# Altium project Banker.PrjPCB (part 4 of 5)

## Sheet Supply.SchDoc: Power
size 420 x 297 mm; Author: G.K.; CompanyName: WUT; DrawnBy: G.K.; Organization: CERN; Address1: Warsaw Univeristy of Technology; Address2: Nowowiejska 15/19; DocumentNumber: 3; Revision: -; SheetNumber: 3; SheetTotal: 10; EDA_Number: ARTIQ; Projet: Banker; ModifiedBy: -; CreateDate: XX/XX/XXXX; CheckedDate: -; Title2: Supply; DivGrp: ISE; Designer: G.K.; ModifiedDate: -; ProjectName: ADC/DAC MEZZANINE
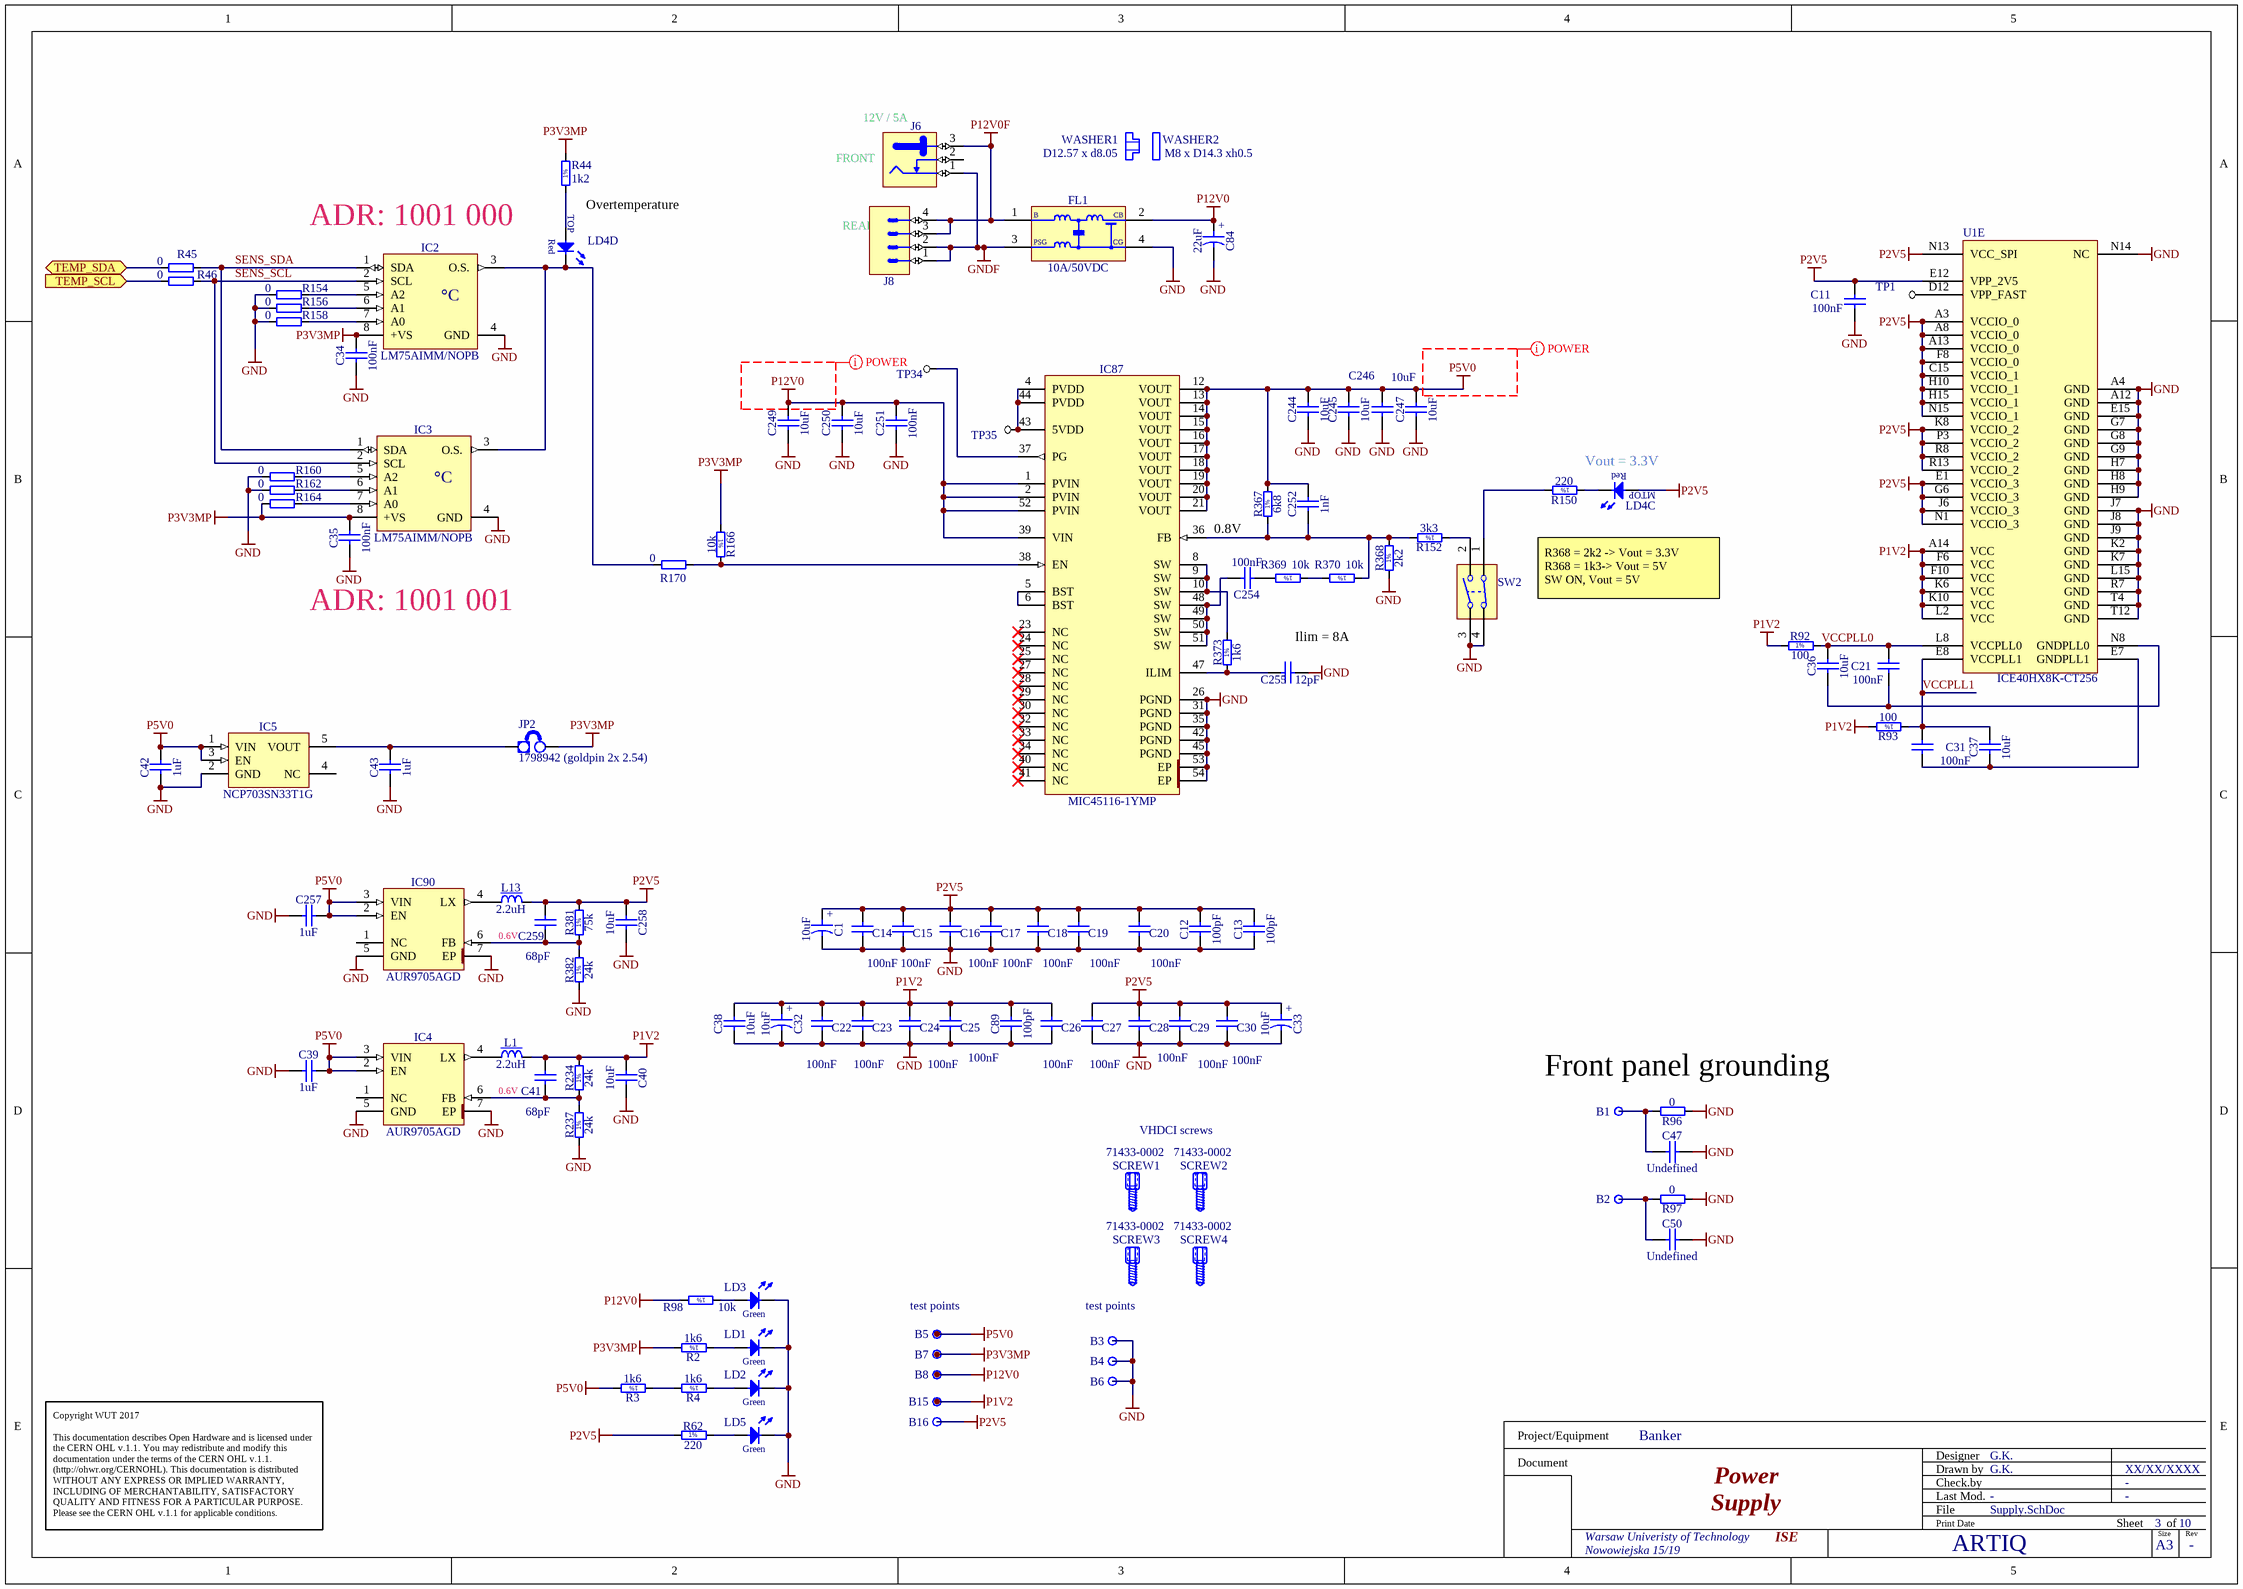
[diagram p7: Supply.SchDoc]

### Parts
B1  Plated Hole  [MTG270_500]  (value not drawn)
B2  Plated Hole  [MTG270_500]  (value not drawn)
B3  Plated Hole  [c130h60]  (value not drawn)
B4  Plated Hole  [c130h60]  (value not drawn)
B5  Plated Hole  [c130h60]  (value not drawn)
B6  Plated Hole  [c130h60]  (value not drawn)
B7  Plated Hole  [c130h60]  (value not drawn)
B8  Plated Hole  [c130h60]  (value not drawn)
B15  Plated Hole  [c130h60]  (value not drawn)
B16  Plated Hole  [c130h60]  (value not drawn)
C1  10uF  [CAPAE430X540N]
C11  100nF  [CAPC1005X55N]
C12  100pF  [CAPC1608X87N]
C13  100pF  [CAPC1608X87N]
C14  100nF  [CAPC1005X55N]
C15  100nF  [CAPC1005X55N]
C16  100nF  [CAPC1005X55N]
C17  100nF  [CAPC1005X55N]
C18  100nF  [CAPC1005X55N]
C19  100nF  [CAPC1005X55N]
C20  100nF  [CAPC1005X55N]
C21  100nF  [CAPC1005X55N]
C22  100nF  [CAPC1005X55N]
C23  100nF  [CAPC1005X55N]
C24  100nF  [CAPC1005X55N]
C25  100nF  [CAPC1005X55N]
C26  100nF  [CAPC1005X55N]
C27  100nF  [CAPC1005X55N]
C28  100nF  [CAPC1005X55N]
C29  100nF  [CAPC1005X55N]
C30  100nF  [CAPC1005X55N]
C31  100nF  [CAPC1005X55N]
C32  10uF  [CAPAE430X540N]
C33  10uF  [CAPAE430X540N]
C34  100nF  [CAPC1005X55N]
C35  100nF  [CAPC1005X55N]
C36  10uF  [CAPC1005X70N]
C37  10uF  [CAPC1005X70N]
C38  10uF  [CAPC2012X135N]
C39  1uF  [CAPC1005X55N]
C40  10uF  [CAPC2012X135N]
C41  68pF  [CAPC1608X87N]
C42  1uF  [CAPC2012X140N]
C43  1uF  [CAPC2012X140N]
C47  Undefined  [CAPC2012X135N]
C50  Undefined  [CAPC2012X135N]
C84  22uF  [CAPAE530X540N]
C89  100pF  [CAPC1608X87N]
C244  10uF  [CAPC2012X135N]
C245  10uF  [CAPC2012X135N]
C246  10uF  [CAPC2012X135N]
C247  10uF  [CAPC2012X135N]
C249  10uF  [CAPC2012X135N]
C250  10uF  [CAPC2012X135N]
C251  100nF  [CAPC1005X55N]
C252  1nF  [CAPC1608X87N]
C254  100nF  [CAPC1005X55N]
C255  12pF  [CAPC1005X55N]
C257  1uF  [CAPC1005X55N]
C258  10uF  [CAPC2012X135N]
C259  68pF  [CAPC1608X87N]
FL1  10A/50VDC  [FIL_MURATA_BNX02]
IC2  LM75AIMM/NOPB  [SOP65P490X109-8N]
IC3  LM75AIMM/NOPB  [SOP65P490X109-8N]
IC4  AUR9705AGD  [SON65P200X200X80-7N-R65X145]
IC5  NCP703SN33T1G  [SOT95P275X110-5N]
IC87  MIC45116-1YMP  [MICROCHIP_H3QFN88-52LD-PL-3]
IC90  AUR9705AGD  [SON65P200X200X80-7N-R65X145]
J6  Jack  [SWITCHCRAFT_L712RA]  (value not drawn)
J8  Mini-Fit Jr.™  [MOLEX_39-30-0040]  (value not drawn)
JP2  1798942 (goldpin 2x 2.54)  [jump]
L1  2.2uH  [IND_MURATA_LQH44PN_P0]
L13  2.2uH  [IND_MURATA_LQH44PN_P0]
LD1  Green  [LED_KINGBRIGHT_KPH-1608CGCK]  (value not drawn)
LD2  Green  [LED_KINGBRIGHT_KPH-1608CGCK]  (value not drawn)
LD3  Green  [LED_KINGBRIGHT_KPH-1608CGCK]  (value not drawn)
LD4  Green/Green/HeRed/HeRed  [LED_BIVAR_H485CHHGGDL]  (value not drawn)  (parts C,D of 4)
LD5  Green  [LED_KINGBRIGHT_KPH-1608CGCK]  (value not drawn)
R2  1k6  [RESC1005X40N]
R3  1k6  [RESC1005X40N]
R4  1k6  [RESC1005X40N]
R44  1k2  [RESC1608X55N]
R45  0  [RESC1005X40N]
R46  0  [RESC1005X40N]
R62  220  [RESC1608X55N]
R92  100  [RESC1005X40N]
R93  100  [RESC1005X40N]
R96  0  [RESC1608X55N]
R97  0  [RESC1608X55N]
R98  10k  [RESC1005X40N]
R150  220  [RESC1608X55N]
R152  3k3  [RESC1005X40N]
R154  0  [RESC1005X40N]
R156  0  [RESC1005X40N]
R158  0  [RESC1005X40N]
R160  0  [RESC1005X40N]
R162  0  [RESC1005X40N]
R164  0  [RESC1005X40N]
R166  10k  [RESC1005X40N]
R170  0  [RESC1005X40N]
R234  24k  [RESC1005X40N]
R237  24k  [RESC1005X40N]
R367  6k8  [RESC1005X40N]
R368  2k2  [RESC1608X55N]
R369  10k  [RESC1005X40N]
R370  10k  [RESC1005X40N]
R373  1k6  [RESC1005X40N]
R381  75k  [RESC1005X40N]
R382  24k  [RESC1005X40N]
SCREW1  71433-0002  [MOLEX_71433-0002]
SCREW2  71433-0002  [MOLEX_71433-0002]
SCREW3  71433-0002  [MOLEX_71433-0002]
SCREW4  71433-0002  [MOLEX_71433-0002]
SW2  Switch  [SW_CTS_204-121ST]  (value not drawn)
TP1  TP  [TP]  (value not drawn)
TP34  TP  [TP]  (value not drawn)
TP35  TP  [TP]  (value not drawn)
U1  ICE40HX8K-CT256  [LATC-caBGA-256]  (part E of 5)
WASHER1  D12.57 x d8.05  [Washer_s4263]
WASHER2  M8 x D14.3 xh0.5  [Washer_M8x0.5x14.3]

### Ports
TEMP_SCL (in), TEMP_SDA (bidir)

### Nets
GND: B3.1 B4.1 B6.1 C1.2 C11.1 C12.1 C13.1 C14.1 C15.1 C16.1 C17.1 C18.1 C19.1 C20.1 C22.1 C23.1 C24.1 C25.1 C26.1 C27.1 C28.1 C29.1 C30.1 C32.2 C33.2 C34.1 C35.1 C38.1 C39.1 C40.2 C42.1 C43.1 C47.2 C50.2 C84.2 C89.1 C244.1 C245.1 C246.1 C247.1 C249.1 C250.1 C251.1 C255.1 C257.1 C258.2 FL1.4(CG) IC2.4(GND) IC3.4(GND) IC4.5(GND) IC4.7(EP) IC5.2(GND) IC87.26(PGND) IC87.31(PGND) IC87.35(PGND) IC87.42(PGND) IC87.45(PGND) IC87.53(EP) IC87.54(EP) IC90.5(GND) IC90.7(EP) LD1.1(C) LD2.1(C) LD3.1(C) LD5.1(C) R96.1 R97.1 R154.1 R156.1 R158.1 R160.1 R162.1 R237.1 R368.1 R382.1 SW2.3 SW2.4 U1.A4(GND) U1.A12(GND) U1.E15(GND) U1.G7(GND) U1.G8(GND) U1.G9(GND) U1.H7(GND) U1.H8(GND) U1.H9(GND) U1.J7(GND) U1.J8(GND) U1.J9(GND) U1.K2(GND) U1.K7(GND) U1.L15(GND) U1.N14(NC) U1.R7(GND) U1.T4(GND) U1.T12(GND)
GNDF: FL1.3(PSG) J6.1 J8.1 J8.2
P1V2: B15.1 C22.2 C23.2 C24.2 C25.2 C26.2 C32.1 C38.2 C40.1 C41.2 C89.2 L1.2 R92.1 R93.2 R234.2 U1.A14(VCC) U1.F6(VCC) U1.F10(VCC) U1.K6(VCC) U1.K10(VCC) U1.L2(VCC)
P2V5: B16.1 C1.1 C11.2 C12.2 C13.2 C14.2 C15.2 C16.2 C17.2 C18.2 C19.2 C20.2 C27.2 C28.2 C29.2 C30.2 C33.1 C258.1 C259.2 L13.2 LD4.6(A) R62.1 R381.2 U1.A3(VCCIO_0) U1.A8(VCCIO_0) U1.A13(VCCIO_0) U1.C15(VCCIO_1) U1.E1(VCCIO_3) U1.E12(VPP_2V5) U1.F8(VCCIO_0) U1.G6(VCCIO_3) U1.H10(VCCIO_1) U1.H15(VCCIO_1) U1.J6(VCCIO_3) U1.K8(VCCIO_2) U1.N1(VCCIO_3) U1.N13(VCC_SPI) U1.N15(VCCIO_1) U1.P3(VCCIO_2) U1.R8(VCCIO_2) U1.R13(VCCIO_2)
P3V3MP: B7.1 C34.2 C35.2 IC2.8(+VS) IC3.8(+VS) JP2.2(E2) R2.2 R44.2 R164.1 R166.1
P5V0: B5.1 C39.2 C42.2 C244.2 C245.2 C246.2 C247.2 C252.2 C257.2 IC4.2(EN) IC4.3(VIN) IC5.1(VIN) IC5.3(EN) IC87.12(VOUT) IC87.13(VOUT) IC87.14(VOUT) IC87.15(VOUT) IC87.16(VOUT) IC87.17(VOUT) IC87.18(VOUT) IC87.19(VOUT) IC87.20(VOUT) IC87.21(VOUT) IC90.2(EN) IC90.3(VIN) R3.2 R367.2
P12V0: B8.1 C84.1 C249.2 C250.2 C251.2 FL1.2(CB) IC87.1(PVIN) IC87.2(PVIN) IC87.39(VIN) IC87.52(PVIN) R98.2
P12V0F: FL1.1(B) J6.3 J8.3 J8.4
SENS_SCL: IC2.2(SCL) IC3.2(SCL) R46.2
SENS_SDA: IC2.1(SDA) IC3.1(SDA) R45.2
TEMP_SCL: R46.1 ; port TEMP_SCL
TEMP_SDA: R45.1 ; port TEMP_SDA
VCCPLL0: C21.2 C36.2 R92.2 U1.L8(VCCPLL0)
VCCPLL1: C31.2 C37.2 R93.1 U1.E8(VCCPLL1)
NetB1_1: B1.1 C47.1 R96.2
NetB2_1: B2.1 C50.1 R97.2
NetC21_1: C21.1 C36.1 U1.N8(GNDPLL0)
NetC31_1: C31.1 C37.1 U1.E7(GNDPLL1)
NetC41_1: C41.1 IC4.6(FB) R234.1 R237.2
NetC43_2: C43.2 IC5.5(VOUT) JP2.1(E1)
NetC252_1: C252.1 IC87.36(FB) R152.2 R367.1 R368.2 R370.1
NetC254_1: C254.1 R369.2
NetC254_2: C254.2 IC87.48(SW) IC87.49(SW) IC87.50(SW) IC87.51(SW)
NetC255_2: C255.2 IC87.47(ILIM) R373.1
NetC259_1: C259.1 IC90.6(FB) R381.1 R382.2
NetIC2_3: IC2.3(O.S.) IC3.3(O.S.) LD4.7(C) R170.1
NetIC2_5: IC2.5(A2) R154.2
NetIC2_6: IC2.6(A1) R156.2
NetIC2_7: IC2.7(A0) R158.2
NetIC3_5: IC3.5(A2) R160.2
NetIC3_6: IC3.6(A1) R162.2
NetIC3_7: IC3.7(A0) R164.2
NetIC4_4: IC4.4(LX) L1.1
NetIC87_4: IC87.4(PVDD) IC87.43(5VDD) IC87.44(PVDD) TP35.1
NetIC87_5: IC87.5(BST) IC87.6(BST)
NetIC87_8: IC87.8(SW) IC87.9(SW) IC87.10(SW) R373.2
NetIC87_37: IC87.37(PG) TP34.1
NetIC87_38: IC87.38(EN) R166.2 R170.2
NetIC90_4: IC90.4(LX) L13.1
NetLD1_2: LD1.2(A) R2.1
NetLD2_2: LD2.2(A) R4.1
NetLD3_2: LD3.2(A) R98.1
NetLD4_5: LD4.5(C) R150.1
NetLD4_8: LD4.8(A) R44.1
NetLD5_2: LD5.2(A) R62.2
NetR3_1: R3.1 R4.2
NetR150_2: R150.2 SW2.1
NetR152_1: R152.1 SW2.2
NetR369_1: R369.1 R370.2
NetTP1_1: TP1.1 U1.D12(VPP_FAST)

Not connected (* = marked no-connect by the designer): IC4 1(NC); IC5 4(NC); IC87 23(NC)* 24(NC)* 25(NC)* 27(NC)* 28(NC)* 29(NC)* 30(NC)* 32(NC)* 33(NC)* 34(NC)* 40(NC)* 41(NC)*; IC90 1(NC); J6 2

### Layout directives
net class POWER: P5V0, P12V0

### Notes on the sheet
- (near J6) 12V / 5A
- FRONT
- ADR: 1001 000
- Overtemperature
- (near J8) REAR
- 0.8V
- Vout = 3.3V
- R368 = 2k2 -> Vout = 3.3V
  R368 = 1k3-> Vout = 5V
  SW ON, Vout = 5V
- (near C35) ADR: 1001 001
- (near C255) Ilim = 8A
- 0.6V
- VHDCI screws
- Front panel grounding
- (near B5) test points
- test points
- Copyright WUT 2017
  This documentation describes Open Hardware and is licensed under the CERN OHL v.1.1. You may redistribute and modify this documentation under the terms of the CERN OHL v.1.1. (http://ohwr.org/CERNOHL). This documentation is distributed WITHOUT ANY EXPRESS OR IMPLIED WARRANTY, INCLUDING OF MERCHANTABILITY, SATISFACTORY QUALITY AND FITNESS FOR A PARTICULAR PURPOSE. Please see the CERN OHL v.1.1 for applicable conditions.
- Project/Equipment
- Document
- Designer
- Drawn by
- Check.by
- File
- Last Mod.
- Print Date
- Sheet
- Size
- A3
- of
- Rev
- (in symbol CAE430-540_10UF_16V_20%) +
- (in symbol CAE530-540_22UF_16V_20%) +
- (in symbol LED_BIVAR_H485CHHGGDL, part C) Red; MTOP
- (in symbol LED_BIVAR_H485CHHGGDL, part D) TOP; Red
- (in symbol LM75AIMM/NOPB) °C
- (in symbol R0402_1K6_1%_0.0625W_100PPM) 1%
- (in symbol R0402_3K3_1%_0.0625W_100PPM) 1%
- (in symbol R0402_6K8_1%_0.0625W_100PPM) 1%
- (in symbol R0402_10K_1%_0.0625W_100PPM) 1%
- (in symbol R0402_24K_1%_0.0625W_100PPM) 1%
- (in symbol R0402_75K_1%_0.0625W_100PPM) 1%
- (in symbol R0402_100R_1%_0.0625W_100PPM) 1%
- (in symbol R0603_1K2_1%_0.1W_100PPM) 1%
- (in symbol R0603_2k2_1%_0.1W_100PPM) 1%
- (in symbol R0603_220R_1%_0.1W_100PPM) 1%

### Library data of the parts
B1 B2 = PLATED_HOLE2.7_PAD5.0: Single Terminal Socket; Part Description: Plated Through Hole: Hole Dia.=2.7mm Pad Dia.=5.0mm; Mounted: No; Part Number: PLATED_HOLE2.7_PAD5.0; Component Kind: Standard (No BOM); Component Type: Standard (No BOM); Pin Count: 1; Family: Plated Hole; Socket: No; SMD: No; Sense: No; Status: None; ComponentHeight: 0mm; HelpURL: Undefined; Author: CERN DEM JMW; CreateDate: 27.09.2011; LatestRevisionDate: 27.09.2011; PackageDescription: Plated Through Hole: Hole Dia.=2.7mm Pad Dia.=5.0mm
B3-B8 B15 B16 = PLATED_HOLE0.6_PAD1.3: Single Terminal Socket; Part Description: Plated Through Hole: Hole Dia.=0.6mm Pad Dia.=1.3mm; Mounted: No; Part Number: PLATED_HOLE0.6_PAD1.3; Component Kind: Standard (No BOM); Component Type: Standard (No BOM); Pin Count: 1; Family: Plated Hole; Socket: No; SMD: No; Sense: No; Status: None; ComponentHeight: 0mm; HelpURL: Undefined; Author: CERN DEM MR; CreateDate: 02.03.2016; LatestRevisionDate: 02.03.2016; PackageDescription: Plated Through Hole: Hole Dia.=0.6mm Pad Dia.=1.3mm
C1 C32 C33 = CAE430-540_10UF_16V_20%: Polarised capacitor; Part Description: Aluminum Electrolytic SMT Capacitor; Manufacturer: PANASONIC; Manufacturer Part Number: EEEFK1C100AR; Voltage: 16V; Tolerance: ±20%; Part Number: CAE430-540_10UF_16V_20%; Component Kind: Standard; Component Type: Standard; Pin Count: 2; Value: 10uF; Status: Not Recommended; Case: B; Mounted: Yes; Socket: No; SMD: Yes; Sense: No; ComponentHeight: 5.8mm; HelpURL: \\cern.ch\dfs\Applications\Altium\Datasheets\CAE_PANASONIC_FK.pdf; Author: CERN DEM JLC; CreateDate: 03.12.2007; LatestRevisionDate: 05.11.2014
C11 C14-C31 C251 C254 = CC0402_100NF_16V_10%_X5R: Non-polarised capacitor; Part Description: SMD Multilayer Chip Ceramic Capacitor; Manufacturer: GENERIC; Manufacturer1 Part Number: GRM155R61C104KA88D; Voltage: 16V; TC: X5R; Tolerance: ±10%; Table: Capacitors SMD; Part Number: CC0402_100NF_16V_10%_X5R; Component Kind: Standard; Component Type: Standard; Pin Count: 2; Value: 100nF; Status: None; Manufacturer Part Number: CC0402_100NF_16V_10%_X5R; Case: 0402; Mounted: Yes; Socket: No; SMD: Yes; Manufacturer1 Example: MURATA; Manufacturer1 ComponentHeight: 0.55mm; HelpURL: \\cern.ch\dfs\Applications\Altium\Datasheets\CC0402_X5R_MURATA_GRM.pdf; Author: CERN DEM JLC; CreateDate: 2013-12-10; LatestRevisionDate: 2013-12-10
C12 C13 C89 = CC0603_100PF_50V_10%_X7R: Non-polarised capacitor; Part Description: SMD Multilayer Chip Ceramic Capacitor; Manufacturer: GENERIC; Manufacturer1 Part Number: 223858615609; Voltage: 50V; TC: X7R; Tolerance: ±10%; Table: Capacitors SMD; Part Number: CC0603_100PF_50V_10%_X7R; Component Kind: Standard; Component Type: Standard; Pin Count: 2; Value: 100pF; Status: Preferred; Manufacturer Part Number: CC0603_100PF_50V_10%_X7R; Case: 0603; Mounted: Yes; Socket: No; SMD: Yes; Manufacturer1 Example: PHYCOMP; Manufacturer1 ComponentHeight: 0.9mm; HelpURL: \\cern.ch\dfs\Applications\Altium\Datasheets\CC0603_X7R_PHYCOMP.pdf; Author: CERN DEM JLC; CreateDate: 2012-08-15; LatestRevisionDate: 2012-08-15
C34 C35 = CC0402_100NF_16V_10%_X5R: as C85 on sheet FPGA; Part Number: CC0402_100NF_16V_10%_X5R; Component Kind: Standard; Component Type: Standard; Pin Count: 2; Value: 100nF; Status: None; Manufacturer Part Number: CC0402_100NF_16V_10%_X5R; Case: 0402; Mounted: Yes; Socket: No; SMD: Yes; Sense: No; Manufacturer1 Example: MURATA; Manufacturer1 ComponentHeight: 0.55mm; HelpURL: \\cern.ch\dfs\Applications\Altium\Datasheets\CC0402_X5R_MURATA_GRM.pdf; Author: CERN DEM JLC; CreateDate: 10.12.2013; LatestRevisionDate: 10.12.2013
C36 C37 = CC0402_10UF_6.3V_20%_X5R: Non-polarised capacitor; Part Description: SMD Multilayer Chip Ceramic Capacitor; Manufacturer: GENERIC; Manufacturer1 Part Number: C1005X5R0J106M050BC; Voltage: 6.3V; TC: X5R; Tolerance: ±10%; Part Number: CC0402_10UF_6.3V_20%_X5R; Component Kind: Standard; Component Type: Standard; Pin Count: 2; Value: 10uF; Status: Preferred; Manufacturer Part Number: CC0402_10UF_6.3V_20%_X5R; Case: 0402; Mounted: Yes; Socket: No; SMD: Yes; Manufacturer1 Example: TDK; Manufacturer1 ComponentHeight: 0.70mm; HelpURL: \\cern.ch\dfs\Applications\Altium\Datasheets\CC0402_X5R_TDK_C.pdf; Author: CERN DEM JLC; CreateDate: 07.01.2015; LatestRevisionDate: 07.01.2015; Sense: No
C38 C40 C244-C247 C249 C250 C258 = CC0805_10UF_16V_10%_X5R: Non-polarised capacitor; Part Description: SMD Multilayer Chip Ceramic Capacitor; Manufacturer: GENERIC; Manufacturer1 Part Number: C0805C106K4PAC; Voltage: 16V; TC: X5R; Tolerance: ±10%; Part Number: CC0805_10UF_16V_10%_X5R; Component Kind: Standard; Component Type: Standard; Pin Count: 2; Value: 10uF; Status: Preferred; Manufacturer Part Number: CC0805_10UF_16V_10%_X5R; Case: 0805; Mounted: Yes; Socket: No; SMD: Yes; Manufacturer1 Example: KEMET; Manufacturer1 ComponentHeight: 1.4mm; HelpURL: \\cern.ch\dfs\Applications\Altium\Datasheets\CC1206_X5R_KEMET.pdf; Author: CERN DEM JLC; CreateDate: 03.12.2007; LatestRevisionDate: 03.12.2007; Sense: No
C39 C257 = CC0402_1UF_16V_10%_X5R: Non-polarised capacitor; Part Description: SMD Multilayer Chip Ceramic Capacitor; Manufacturer: GENERIC; Manufacturer1 Part Number: C1005X5R1C105KT; Voltage: 16V; TC: X5R; Tolerance: ±10%; Part Number: CC0402_1UF_16V_10%_X5R; Component Kind: Standard; Component Type: Standard; Pin Count: 2; Value: 1uF; Status: Preferred; Manufacturer Part Number: CC0402_1UF_16V_10%_X5R; Case: 0402; Mounted: Yes; Socket: No; SMD: Yes; Sense: No; Manufacturer1 Example: TDK; Manufacturer1 ComponentHeight: 0.55mm; HelpURL: \\cern.ch\dfs\Applications\Altium\Datasheets\CC0402_X5R_TDK_C.pdf; Author: CERN DEM JLC; CreateDate: 25.10.2012; LatestRevisionDate: 25.10.2012
C41 C259 = CC0603_68PF_50V_5%_NP0: Non-polarised capacitor; Part Description: SMD Multilayer Chip Ceramic Capacitor; Manufacturer: GENERIC; Manufacturer1 Part Number: 223886715689; Voltage: 50V; TC: C0G/NP0; Tolerance: ±5%; Part Number: CC0603_68PF_50V_5%_NP0; Component Kind: Standard; Component Type: Standard; Pin Count: 2; Value: 68pF; Status: Preferred; Manufacturer Part Number: CC0603_68PF_50V_5%_NP0; Case: 0603; Mounted: Yes; Socket: No; SMD: Yes; Sense: No; Manufacturer1 Example: PHYCOMP; Manufacturer1 ComponentHeight: 0.87mm; HelpURL: \\cern.ch\dfs\Applications\Altium\Datasheets\CC0603_NP0_PHYCOMP.pdf; Author: CERN DEM JLC; CreateDate: 03.12.2007; LatestRevisionDate: 03.12.2007
C42 C43 = CC0805_1UF_35V_20%_X7R: Non-polarised capacitor; Part Description: SMD Multilayer Chip Ceramic Capacitor; Manufacturer: GENERIC; Manufacturer1 Part Number: GMK212B7105MG-T; Voltage: 35V; TC: X7R; Tolerance: ±20%; Part Number: CC0805_1UF_35V_20%_X7R; Component Kind: Standard; Component Type: Standard; Pin Count: 2; Value: 1uF; Status: Not Recommended; Manufacturer Part Number: CC0805_1UF_35V_20%_X7R; Case: 0805; Mounted: Yes; Socket: No; SMD: Yes; Sense: No; Manufacturer1 Example: TAIYO YUDEN; Manufacturer1 ComponentHeight: 1.35mm; HelpURL: \\cern.ch\dfs\Applications\Altium\Datasheets\CC0805_X7R_TAIYO-YUDEN_HIGH-VALUE.pdf; Author: CERN DEM JLC; CreateDate: 22.06.2011; LatestRevisionDate: 22.06.2011
C47 C50 = CC0805_NO-VALUE: Non-polarised capacitor; Part Description: Reserved Footprint For 0805(2012) Chip Ceramic Capacitor; Mounted: No; Part Number: CC0805_NO-VALUE; Component Kind: Standard; Component Type: Standard; Pin Count: 2; Value: Undefined; Status: None; Manufacturer: Undefined; Manufacturer Part Number: CC0805_NO-VALUE; Case: 0805; Socket: No; SMD: Yes; Sense: No; Manufacturer1 ComponentHeight: 1.35mm; HelpURL: Undefined; Author: CERN DEM JLC; CreateDate: 10.12.2008; LatestRevisionDate: 11.09.2013
C84 = CAE530-540_22UF_16V_20%: Polarised capacitor; Part Description: Aluminum Electrolytic SMT Capacitor; Manufacturer: PANASONIC; Manufacturer Part Number: EEEFK1C220AR; Voltage: 16V; Tolerance: ±20%; Part Number: CAE530-540_22UF_16V_20%; Component Kind: Standard; Component Type: Standard; Pin Count: 2; Value: 22uF; Status: Not Recommended; Case: B; Mounted: Yes; Socket: No; SMD: Yes; Sense: No; ComponentHeight: 5.8mm; HelpURL: \\cern.ch\dfs\Applications\Altium\Datasheets\CAE_PANASONIC_FK.pdf; Author: CERN DEM JLC; CreateDate: 03.12.2007; LatestRevisionDate: 05.11.2014
C252 = CC0603_1NF_100V_10%_X7R: Non-polarised capacitor; Part Description: SMD Multilayer Chip Ceramic Capacitor; Manufacturer: GENERIC; Manufacturer1 Part Number: C0603C102K1RACTU; Voltage: 100V; TC: X7R; Tolerance: ±10%; Part Number: CC0603_1NF_100V_10%_X7R; Component Kind: Standard; Component Type: Standard; Pin Count: 2; Value: 1nF; Status: Preferred; Manufacturer Part Number: CC0603_1NF_100V_10%_X7R; Case: 0603; Mounted: Yes; Socket: No; SMD: Yes; Sense: No; Manufacturer1 Example: KEMET; Manufacturer1 ComponentHeight: 0.87mm; HelpURL: \\cern.ch\dfs\Applications\Altium\Datasheets\CC0603_X7R_KEMET.pdf; Author: CERN DEM JLC; CreateDate: 12.12.2013; LatestRevisionDate: 12.12.2013
C255 = CC0402_12PF_50V_5%_C0G: Non-polarised capacitor; Part Description: SMD Multilayer Chip Ceramic Capacitor; Manufacturer: GENERIC; Manufacturer1 Part Number: C0402C120J5GACTU; Voltage: 50V; TC: C0G/NP0; Tolerance: ±5%; Part Number: CC0402_12PF_50V_5%_C0G; Component Kind: Standard; Component Type: Standard; Pin Count: 2; Value: 12pF; Status: Preferred; Manufacturer Part Number: CC0402_12PF_50V_5%_C0G; Case: 0402; Mounted: Yes; Socket: No; SMD: Yes; Sense: No; Manufacturer1 Example: KEMET; Manufacturer1 ComponentHeight: 0.55mm; HelpURL: \\cern.ch\dfs\Applications\Altium\Datasheets\CC0805_C0G_KEMET_(Commercial Grade).pdf; Author: CERN DEM JLC; CreateDate: 04.10.2016; LatestRevisionDate: 04.10.2016
FL1 = FIL_MURATA_BNX022-01L: Block Type EMIFIL (LC Combined); Part Description: Block Type EMIFIL (LC Combined) SMD Type, BNX02* Series; Manufacturer: MURATA; Resistance: 0.5R; Part Number: FIL_MURATA_BNX022-01L; Component Kind: Standard; Component Type: Standard; Pin Count: 2; Value: 10A/50VDC; Status: None; Manufacturer Part Number: BNX022-01L; Mounted: Yes; Socket: No; SMD: Yes; Sense: No; ComponentHeight: 3.3mm; HelpURL: \\cern.ch\dfs\Applications\Altium\Datasheets\FIL_MURATA_BNX022-01L.pdf; Author: CERN DEM JLC; CreateDate: 10.10.2012; LatestRevisionDate: 10.10.2012
IC2 IC3 = LM75AIMM/NOPB: Digital Temperature Sensor and Thermal Watchdog with Two-Wire Interface; Part Description: -25° to +100°C ±2°C Digital Temperature Sensor and Thermal Watchdog with Two-Wire Interface; Manufacturer: TEXAS INSTRUMENTS; PressFit: No; Bonding: No; Part Number: LM75AIMM/NOPB; Component Kind: Standard; Component Type: Standard; Device: LM75AIMM/NOPB; PackageDescription: SOP, 0.65mm pitch; 8 pin,3.00mm W X 3.00mm L X 1.09mm H bodyI, PC Medium Density; Manufacturer Part Number: LM75AIMM/NOPB; Pin Count: 8; Case: SSOP8; Mounted: Yes; Socket: No; SMD: Yes; Sense: No; ComponentHeight: 1.09mm; HelpURL: \\cern.ch\dfs\Applications\Altium\Datasheets\LM75AIMM-NOPB.pdf; Author: CERN DEM JLC; CreateDate: 15.10.2012; LatestRevisionDate: 15.10.2012
IC4 IC90 = AUR9705AGD: 0V to 6V Input, 1A, 1.5MHz, Step-Down DC-DC Converter; Manufacturer: DIODES INCORPORATED; PressFit: No; Bonding: No; Part Number: AUR9705AGD; Component Kind: Standard; Component Type: Standard; Device: AUR9705AGD; PackageDescription: SON, 0.65mm Pitch, 6 Pin, 2.00mm W X 2.00mm L X 0.80mm H body (W/Thermal Tab 0.65mm X 1.45mm), IPC Medium Density; Part Description: 0V to 6V Input, 1A, 1.5MHz, Step-Down DC-DC Converter; Manufacturer Part Number: AUR9705AGD; Pin Count: 7; Case: SON6; Mounted: Yes; Socket: No; SMD: Yes; Sense: No; ComponentHeight: 0.8mm; HelpURL: \\cern.ch\dfs\Applications\Altium\Datasheets\AUR9705AGD.pdf; Author: CERN DEM MR; CreateDate: 15.02.2018; LatestRevisionDate: 15.02.2018
IC5 = NCP703SN33T1G: 3.3V 300mA, Ultra-Low Quiescent Current, IQ 12uA, Ultra-Low Noise, LDO Voltage Regulator; Manufacturer: ON SEMICONDUCTOR; PressFit: No; Bonding: No; Part Number: NCP703SN33T1G; Component Kind: Standard; Component Type: Standard; Device: NCP703SN33T1G; PackageDescription: SOT, 0.95mm Pitch; 5 Pin, 1.50mm W X 3.00mm L X 1.10mm H Body, IPC Medium Density; Part Description: 3.3V 300mA, Ultra-Low Quiescent Current, IQ 12uA, Ultra-Low Noise, LDO Voltage Regulator; Manufacturer Part Number: NCP703SN33T1G; Pin Count: 5; Case: SOT23-5; Mounted: Yes; Socket: No; SMD: Yes; Sense: No; ComponentHeight: 1.1mm; HelpURL: \\cern.ch\dfs\Applications\Altium\Datasheets\NCP703SN33T1G.pdf; Author: CERN DEM JLC; CreateDate: 16.02.2017; LatestRevisionDate: 16.02.2017
IC87 = MIC45116-1YMP: 0.8V to 85% PVIN (4.75-19V), 6A Synchronous Step-Down Regulator Module; Manufacturer: MICROCHIP TECHNOLOGY; PressFit: No; Bonding: No; Part Number: MIC45116-1YMP; Component Kind: Standard; Component Type: Standard; Device: MIC45116-1YMP; PackageDescription: MICROCHIP_H3QFN88-52LD-PL-3, 0.50mm Pitch, Square, 52 Pin, 8mm L X 8mm W X 3mm H Body; Part Description: 0.8V to 85% PVIN (4.75-19V), 6A Synchronous Step-Down Regulator Module; Manufacturer Part Number: MIC45116-1YMP; Pin Count: 53; Mounted: Yes; Socket: No; SMD: Yes; Sense: No; ComponentHeight: 3mm; HelpURL: \\cern.ch\dfs\Applications\Altium\Datasheets\MIC45116-1YMP.pdf; Author: CERN DEM JMW; CreateDate: 15.08.2016; LatestRevisionDate: 15.08.2016
J6 = CON_DC_5A_THT_RA: 24V /3. 5A, 2.1mm Diameter Pin, SMD DC Power Supply Connector With  Break Contact; Part Description: 12V/5A, 2.5mm Diameter Pin, THT DC Power Supply Connector With  Break Contact; Manufacturer: SWITCHCRAFT; Manufacturer Part Number: L712RA; PressFit: No; Part Number: SWITCHCRAFT_L712RA; Component Kind: Standard; Component Type: Standard; Pin Count: 3; Family: Jack; Mounted: Yes; Socket: No; SMD: No; Sense: No; Status: None; ComponentHeight: 11mm; HelpURL: \\cern.ch\dfs\Applications\Altium\Datasheets\LUMBERG_161314.pdf; Author: GK; CreateDate: 15.02.2011; LatestRevisionDate: 20.07.2011
J8 = MOLEX_39-30-0040: Connector 4 Male; Part Description: 4.20mm (.165") Pitch Mini-Fit Jr. Header, Dual Row, Right Angle with Snap-in Plastic Peg PCB Lock, 4 Circuits; Manufacturer: MOLEX; PressFit: No; Part Number: MOLEX_39-30-0040; Component Kind: Standard; Component Type: Standard; Pin Count: 4; Family: Mini-Fit Jr.™; Mounted: Yes; Socket: No; SMD: No; Sense: No; Status: None; Manufacturer Part Number: 39-30-0040; ComponentHeight: 11.4mm; HelpURL: \\cern.ch\dfs\Applications\Altium\Datasheets\MOLEX_39-30-0040.pdf; Author: CERN DEM JLC; CreateDate: 02/10/2018; LatestRevisionDate: 02/10/2018
JP2 = JUMPER: Supplier 1: Farnell; Supplier Part Number 1: 1798942
L1 L13 = IND_2.2UH_20%_MURATA_LQH44PN2R2MP0L: Inductor With Core; Part Description: Wire Wound Ferrite Inductor for Power Lines; Manufacturer: MURATA; Power: 1.8A; Resistance: 0R049; Tolerance: ±20%; Part Number: IND_2.2UH_20%_MURATA_LQH44PN2R2MP0L; Component Kind: Standard; Component Type: Standard; Pin Count: 2; Value: 2.2uH; Status: None; Manufacturer Part Number: LQH44PN2R2MP0L; Case: 4040; Mounted: Yes; Socket: No; SMD: Yes; Sense: No; ComponentHeight: 1.8mm; HelpURL: \\cern.ch\dfs\Applications\Altium\Datasheets\IND_MURATA_LQH44PN_P0.pdf; Author: CERN DEM JLC; CreateDate: 14.02.2018; LatestRevisionDate: 14.02.2018
LD1-LD3 LD5 = LED_KINGBRIGHT_KPH-1608CGCK: LED Green 1C 2A; Part Description: SMD Green LED, Case 1.6mmX0.8mm(0603), 0.65mm Thickness; PressFit: No; Bonding: No; Part Number: LED_KINGBRIGHT_KPH-1608CGCK; Component Kind: Standard; Component Type: Standard; Color: Green; PackageDescription: SMT Green LED, Case 0603, Body L 1.6 x W 0.8mm H 0.65mm; Manufacturer: KINGBRIGHT; Manufacturer Part Number: KPH-1608CGCK; Pin Count: 2; Mounted: Yes; Socket: No; SMD: Yes; Sense: No; ComponentHeight: 0.65mm; HelpURL: \\cern.ch\dfs\Applications\Altium\Datasheets\LED_KINGBRIGHT_KPH-1608CGCK.pdf; Author: CERN DEM JLC; CreateDate: 03.07.2017; LatestRevisionDate: 03.07.2017
LD4 = LED_BIVAR_H485CHHGGDL: LED x4 G-1C2A-BOT_G-3C4A_H-5C6A_H-7C8A-TOP; Part Description: Quad-Level 2mm (Green+Green+HeRed+HeRed) LED, PCB Edge Mounting; Manufacturer: BIVAR; PressFit: No; Bonding: No; Part Number: LED_BIVAR_H485CHHGGDL; Component Kind: Standard; Component Type: Standard; Color: Green/Green/HeRed/HeRed; PackageDescription: Quad-Level 2mm (Green+Green+HeRed+HeRed) LED, PCB Edge Mounting  BIVAR H485C Serie; Manufacturer Part Number: H485CHHGGDL; Pin Count: 8; Mounted: Yes; Socket: No; SMD: No; Sense: No; ComponentHeight: 11.3mm; HelpURL: \\cern.ch\dfs\Applications\Altium\Datasheets\LED_BIVAR_H485C.pdf; Author: CERN DEM BC; CreateDate: 12/11/2015; LatestRevisionDate: 12/11/2015; Status: Not Recommended
R2-R4 R373 = R0402_1K6_1%_0.0625W_100PPM: Resistor - 1%; Part Description: General Purpose Thick Film Chip Resistor; Manufacturer: GENERIC; Manufacturer1 Part Number: 232270671602L; TC: ±100ppm/°C; PressFit: No; Part Number: R0402_1K6_1%_0.0625W_100PPM; Component Kind: Standard; Component Type: Standard; Pin Count: 2; Value: 1k6; Status: Not Recommended; Power: 0.0625W; Tolerance: ±1%; Manufacturer Part Number: R0402_1K6_1%_0.0625W_100PPM; Case: 0402; Mounted: Yes; Sense: No; Socket: No; SMD: Yes; Manufacturer1 Example: YAGEO PHYCOMP; Manufacturer1 ComponentHeight: 0.4mm; HelpURL: \\cern.ch\dfs\Applications\Altium\Datasheets\R0402_Phycomp_RC0402.pdf; Author: CERN DEM JLC; CreateDate: 03.12.2007; LatestRevisionDate: 17.10.2012
R44 = R0603_1K2_1%_0.1W_100PPM: Resistor - 1%; Part Description: General Purpose Thick Film Chip Resistor; Manufacturer: GENERIC; Manufacturer1 Part Number: NRC06F1201TRF; Power: 0.1W; TC: ±100ppm/°C; Part Number: R0603_1K2_1%_0.1W_100PPM; Component Kind: Standard; Component Type: Standard; Pin Count: 2; Value: 1k2; Status: Preferred; Tolerance: ±1%; Manufacturer Part Number: R0603_1K2_1%_0.1W_100PPM; Case: 0603; Mounted: Yes; Sense: No; Socket: No; SMD: Yes; Manufacturer1 Example: NIC COMPONENT; Manufacturer1 ComponentHeight: 0.55mm; HelpURL: \\cern.ch\dfs\Applications\Altium\Datasheets\R0603_NIC_NRC.pdf; Author: CERN DEM JLC; CreateDate: 03.12.2007; LatestRevisionDate: 13.03.2008
R45 R46 R154 R156 R158 R160 R162 R164 R170 = R0402_0R_JUMPER: Resistor; Part Description: 1A (0.05R Max DC Resistance) Zero Ohm Jumper; Manufacturer: GENERIC; Manufacturer1 Part Number: 232270591001L; Part Number: R0402_0R_JUMPER; Component Kind: Standard; Component Type: Standard; Pin Count: 2; Value: 0; Status: Not recommended; Manufacturer Part Number: R0402_0R_JUMPER; Case: 0402; Mounted: Yes; Sense: No; Socket: No; SMD: Yes; Manufacturer1 Example: YAGEO PHYCOMP; Manufacturer1 ComponentHeight: 0.4mm; HelpURL: \\cern.ch\dfs\Applications\Altium\Datasheets\R0402_Phycomp_RC0402.pdf; Author: CERN DEM JLC; CreateDate: 03.12.2007; LatestRevisionDate: 17.10.2012
R62 R150 = R0603_220R_1%_0.1W_100PPM: Resistor - 1%; Part Description: General Purpose Thick Film Chip Resistor; Manufacturer: GENERIC; Manufacturer1 Part Number: NRC06F2200TRF; Power: 0.1W; TC: ±100ppm/°C; Part Number: R0603_220R_1%_0.1W_100PPM; Component Kind: Standard; Component Type: Standard; Pin Count: 2; Value: 220; Status: Preferred; Tolerance: ±1%; Manufacturer Part Number: R0603_220R_1%_0.1W_100PPM; Case: 0603; Mounted: Yes; Sense: No; Socket: No; SMD: Yes; Manufacturer1 Example: NIC COMPONENT; Manufacturer1 ComponentHeight: 0.55mm; HelpURL: \\cern.ch\dfs\Applications\Altium\Datasheets\R0603_NIC_NRC.pdf; Author: CERN DEM JLC; CreateDate: 03.12.2007; LatestRevisionDate: 13.03.2008
R92 R93 = R0402_100R_1%_0.0625W_100PPM: Resistor - 1%; Part Description: General Purpose Thick Film Chip Resistor; Manufacturer: GENERIC; Manufacturer1 Part Number: 232270671001L; TC: ±100ppm/°C; Table: Resistors SMD; Part Number: R0402_100R_1%_0.0625W_100PPM; Component Kind: Standard; Component Type: Standard; Pin Count: 2; Value: 100; Status: Not recommended; Power: 0.0625W; Tolerance: ±1%; Manufacturer Part Number: R0402_100R_1%_0.0625W_100PPM; Case: 0402; Mounted: Yes; Socket: No; SMD: Yes; Manufacturer1 Example: YAGEO PHYCOMP; Manufacturer1 ComponentHeight: 0.4mm; HelpURL: \\cern.ch\dfs\Applications\Altium\Datasheets\R0402_Phycomp_RC0402.pdf; Author: CERN DEM JLC; CreateDate: 2007-12-03; LatestRevisionDate: 2012-10-17
R96 R97 = R0603_0R_JUMPER: as R232 on sheet I2C_switch; Part Number: R0603_0R_JUMPER; Component Kind: Standard; Component Type: Standard; Pin Count: 2; Value: 0; Status: Preferred; Manufacturer Part Number: R0603_0R_JUMPER; Case: 0603; Mounted: Yes; Sense: No; Socket: No; SMD: Yes; Manufacturer1 Example: NIC COMPONENT; Manufacturer1 ComponentHeight: 0.55mm; HelpURL: \\cern.ch\dfs\Applications\Altium\Datasheets\R0603_NIC_NRC.pdf; Author: CERN DEM JLC; CreateDate: 03.12.2007; LatestRevisionDate: 13.03.2008
R98 = R0402_10K_1%_0.0625W_100PPM: Resistor - 1%; Part Description: General Purpose Thick Film Chip Resistor; Manufacturer: GENERIC; Manufacturer1 Part Number: 232270671003L; TC: ±100ppm/°C; Part Number: R0402_10K_1%_0.0625W_100PPM; Component Kind: Standard; Component Type: Standard; Pin Count: 2; Value: 10k; Status: Not recommended; Power: 0.0625W; Tolerance: ±1%; Manufacturer Part Number: R0402_10K_1%_0.0625W_100PPM; Case: 0402; Mounted: Yes; Sense: No; Socket: No; SMD: Yes; Manufacturer1 Example: YAGEO PHYCOMP; Manufacturer1 ComponentHeight: 0.4mm; HelpURL: \\cern.ch\dfs\Applications\Altium\Datasheets\R0402_Phycomp_RC0402.pdf; Author: CERN DEM JLC; CreateDate: 03.12.2007; LatestRevisionDate: 17.10.2012
R152 = R0402_3K3_1%_0.0625W_100PPM: Resistor - 1%; Part Description: General Purpose Thick Film Chip Resistor; Manufacturer: GENERIC; Manufacturer1 Part Number: 232270673302L; TC: ±100ppm/°C; PressFit: No; Part Number: R0402_3K3_1%_0.0625W_100PPM; Component Kind: Standard; Component Type: Standard; Pin Count: 2; Value: 3k3; Status: Not Recommended; Power: 0.0625W; Tolerance: ±1%; Manufacturer Part Number: R0402_3K3_1%_0.0625W_100PPM; Case: 0402; Mounted: Yes; Sense: No; Socket: No; SMD: Yes; Manufacturer1 Example: YAGEO PHYCOMP; Manufacturer1 ComponentHeight: 0.4mm; HelpURL: \\cern.ch\dfs\Applications\Altium\Datasheets\R0402_Phycomp_RC0402.pdf; Author: CERN DEM JLC; CreateDate: 03/12/2007; LatestRevisionDate: 17/10/2012
R166 = R0402_10K_1%_0.0625W_100PPM: as R24 on sheet I2C_switch; Part Number: R0402_10K_1%_0.0625W_100PPM; Component Kind: Standard; Component Type: Standard; Pin Count: 2; Value: 10k; Status: Not Recommended; Power: 0.0625W; Tolerance: ±1%; Manufacturer Part Number: R0402_10K_1%_0.0625W_100PPM; Case: 0402; Mounted: Yes; Sense: No; Socket: No; SMD: Yes; Manufacturer1 Example: YAGEO PHYCOMP; Manufacturer1 ComponentHeight: 0.4mm; HelpURL: \\cern.ch\dfs\Applications\Altium\Datasheets\R0402_Phycomp_RC0402.pdf; Author: CERN DEM JLC; CreateDate: 03.12.2007; LatestRevisionDate: 17.10.2012
R234 R237 R382 = R0402_24K_1%_0.0625W_100PPM: Resistor - 1%; Part Description: General Purpose Thick Film Chip Resistor; Manufacturer: GENERIC; Manufacturer1 Part Number: 232270672403L; TC: ±100ppm/°C; PressFit: No; Part Number: R0402_24K_1%_0.0625W_100PPM; Component Kind: Standard; Component Type: Standard; Pin Count: 2; Value: 24k; Status: Not Recommended; Power: 0.0625W; Tolerance: ±1%; Manufacturer Part Number: R0402_24K_1%_0.0625W_100PPM; Case: 0402; Mounted: Yes; Sense: No; Socket: No; SMD: Yes; Manufacturer1 Example: YAGEO PHYCOMP; Manufacturer1 ComponentHeight: 0.4mm; HelpURL: \\cern.ch\dfs\Applications\Altium\Datasheets\R0402_Phycomp_RC0402.pdf; Author: CERN DEM JLC; CreateDate: 03/12/2007; LatestRevisionDate: 17/10/2012
R367 = R0402_6K8_1%_0.0625W_100PPM: Resistor - 1%; Part Description: General Purpose Thick Film Chip Resistor; Manufacturer: GENERIC; Manufacturer1 Part Number: 232270676802L; TC: ±100ppm/°C; PressFit: No; Part Number: R0402_6K8_1%_0.0625W_100PPM; Component Kind: Standard; Component Type: Standard; Pin Count: 2; Value: 6k8; Status: Not Recommended; Power: 0.0625W; Tolerance: ±1%; Manufacturer Part Number: R0402_6K8_1%_0.0625W_100PPM; Case: 0402; Mounted: Yes; Sense: No; Socket: No; SMD: Yes; Manufacturer1 Example: YAGEO PHYCOMP; Manufacturer1 ComponentHeight: 0.4mm; HelpURL: \\cern.ch\dfs\Applications\Altium\Datasheets\R0402_Phycomp_RC0402.pdf; Author: CERN DEM JLC; CreateDate: 03.12.2007; LatestRevisionDate: 17.10.2012
R368 = R0603_2k2_1%_0.1W_100PPM: Resistor - 1%; Part Description: General Purpose Thick Film Chip Resistor; Manufacturer: GENERIC; Manufacturer1 Part Number: NRC06F2201TRF; Power: 0.1W; TC: ±100ppm/°C; PressFit: No; Part Number: R0603_2K2_1%_0.1W_100PPM; Component Kind: Standard; Component Type: Standard; Pin Count: 2; Value: 2k2; Status: Preferred; Tolerance: ±1%; Manufacturer Part Number: R0603_2K2_1%_0.1W_100PPM; Case: 0603; Mounted: Yes; Sense: No; Socket: No; SMD: Yes; Manufacturer1 Example: NIC COMPONENT; Manufacturer1 ComponentHeight: 0.55mm; HelpURL: \\cern.ch\dfs\Applications\Altium\Datasheets\R0603_NIC_NRC.pdf; Author: CERN DEM JLC; CreateDate: 03/12/2007; LatestRevisionDate: 13/03/2008
R369 R370 = R0402_10K_1%_0.0625W_100PPM: as R146 on sheet I2C_switch; Part Number: R0402_10K_1%_0.0625W_100PPM; Component Kind: Standard; Component Type: Standard; Pin Count: 2; Value: 10k; Status: Not recommended; Power: 0.0625W; Tolerance: ±1%; Manufacturer Part Number: R0402_10K_1%_0.0625W_100PPM; Case: 0402; Mounted: Yes; Socket: No; SMD: Yes; Manufacturer1 Example: YAGEO PHYCOMP; Manufacturer1 ComponentHeight: 0.4mm; HelpURL: \\cern.ch\dfs\Applications\Altium\Datasheets\R0402_Phycomp_RC0402.pdf; Author: CERN DEM JLC; CreateDate: 2007-12-03; LatestRevisionDate: 2012-10-17
R381 = R0402_75K_1%_0.0625W_100PPM: Resistor - 1%; Part Description: General Purpose Thick Film Chip Resistor; Manufacturer: GENERIC; Manufacturer1 Part Number: 232270677503L; TC: ±100ppm/°C; PressFit: No; Part Number: R0402_75K_1%_0.0625W_100PPM; Component Kind: Standard; Component Type: Standard; Pin Count: 2; Value: 75k; Status: Not Recommended; Power: 0.0625W; Tolerance: ±1%; Manufacturer Part Number: R0402_75K_1%_0.0625W_100PPM; Case: 0402; Mounted: Yes; Sense: No; Socket: No; SMD: Yes; Manufacturer1 Example: YAGEO PHYCOMP; Manufacturer1 ComponentHeight: 0.4mm; HelpURL: \\cern.ch\dfs\Applications\Altium\Datasheets\R0402_Phycomp_RC0402.pdf; Author: CERN DEM JLC; CreateDate: 03/12/2007; LatestRevisionDate: 17/10/2012
SCREW1-SCREW4 = MECH_VHDCI_screw_lock: VHDCI Female Screw Lock; Part Description: D-Sub Female Screw Locks, Thread Size: Socket MOLEX_71433-0002; Manufacturer: Molex; PressFit: No; Part Number: MOLEX_71433-0002; Component Kind: Standard; Component Type: Mechanical; Pin Count: 0; PackageDescription: D-Sub Female Screw Locks, Thread Size: Socket; Mounted: Yes; Socket: No; SMD: No; Sense: No; Status: None; Value: 71433-0002; Manufacturer Part Number: 71433-0002; ComponentHeight: 5.48mm; HelpURL: \\cern.ch\dfs\Applications\Altium\Datasheets\TYCO_749087-2.pdf; Author: GK; CreateDate: 10.09.2013; LatestRevisionDate: 10.09.2013
SW2 = SW_CTS_204-121ST: 2x SPST DIP Switch 1NO + 1NF; Part Description: Coupled SPST DIP Switch, 1NO + 1NF, CTS 204 Series; Manufacturer: CTS; PressFit: No; Part Number: SW_CTS_204-121ST; Component Kind: Standard; Component Type: Standard; Pin Count: 4; PackageDescription: Body 7.26 x 9.78mm, 2x SPST DIP, 1NO + 1NF Switch, CTS 204 Series; Family: Switch; Mounted: Yes; Socket: No; SMD: Yes; Sense: No; Status: None; Manufacturer Part Number: 204-121ST; ComponentHeight: 10.36mm; HelpURL: \\cern.ch\dfs\Applications\Altium\Datasheets\SW_CTS_204-121ST.pdf; Author: CERN DEM JLC; CreateDate: 28.08.2014; LatestRevisionDate: 28.08.2014
TP1 TP34 TP35 = TP: Testpoint
U1 = CMP-0962-00001-1: as U1 on sheet FPGA; PackageReference: caBGA-256; PackageDescription: 256-Ball Chip Array Ball Grid Array, Body 14 x 14 mm, Pitch 0.8 mm; RoHS: TRUE; Packing: Tray; Mounting Technology: Surface Mount; ComponentLink3URL: http://www.latticesemi.com/lit/docs/package/pkg.pdf; ComponentLink1Description: Manufacturer URL; ComponentLink3Description: Package Specification; Code_JEDEC: MO-275; PackageVersion: Rev. 03.9, 02/2013; ComponentLink1URL: http://www.latticesemi.com/en; ComponentLink2URL: http://www.latticesemi.com/~/media/Documents/DataSheets/iCE/iCE40LPHXFamilyDataSheet.pdf; PartNumber: ICE40HX8K-CT256; ComponentLink2Description: Datasheet; DatasheetVersion: Rev. 02.9
WASHER1 = MECH_Washer_s4263: 8mm_Shoulder Washer; Part Number: Switchcraft_s4263; Part Description: Plastic Shoulder Washer; Manufacturer: Switchcraft; Manufacturer Part Number: s4263; PressFit: No; Component Kind: Standard; Component Type: Mechanical; Pin Count: 0; PackageDescription: Plastic Shoulder Washer; Mounted: Yes; Socket: No; SMD: No; Sense: No; Status: None; Value: D12.57 x d8.05; ComponentHeight: 3.95mm; Author: GK; CreateDate: 28.01.2016; LatestRevisionDate: 28.01.2016
WASHER2 = MECH_Washer_M8x0.5x14.3: M8 x0.5x14.3 Nylon Washer; Part Number: WS-M 8-0.5(14.3); Manufacturer: ADSYS ELEMENTY; PressFit: No; Component Kind: Standard; Component Type: Mechanical; Footprint: WS-M 8-0.5(14.3); Pin Count: 0; PackageDescription: Nylon Washer; Mounted: Yes; Socket: No; SMD: No; Sense: No; Status: None; Value: M8 x D14.3 xh0.5; Part Description: Nylon Washer; Manufacturer Part Number: WS-M 8-0.5(14.3); ComponentHeight: 3.95mm; HelpURL: \\cern.ch\dfs\Applications\Altium\Datasheets\AAVID-THERMALLOY_7721-7PPSG.pdf; Author: GK; CreateDate: 28.01.2016; LatestRevisionDate: 28.01.2016

## Sheet FPGA_Config.SchDoc: FPGA
size 420 x 297 mm; Author: G.K.; CompanyName: WUT; DrawnBy: G.K.; Organization: CERN; Address1: Warsaw Univeristy of Technology; Address2: Nowowiejska 15/19; DocumentNumber: 9; Revision: -; SheetNumber: 9; SheetTotal: 10; EDA_Number: ARTIQ; Projet: Banker; ModifiedBy: -; CreateDate: XX/XX/XXXX; CheckedDate: -; Title2: Configuration; DivGrp: ISE; Designer: G.K.; ModifiedDate: -; ProjectName: ADC/DAC MEZZANINE
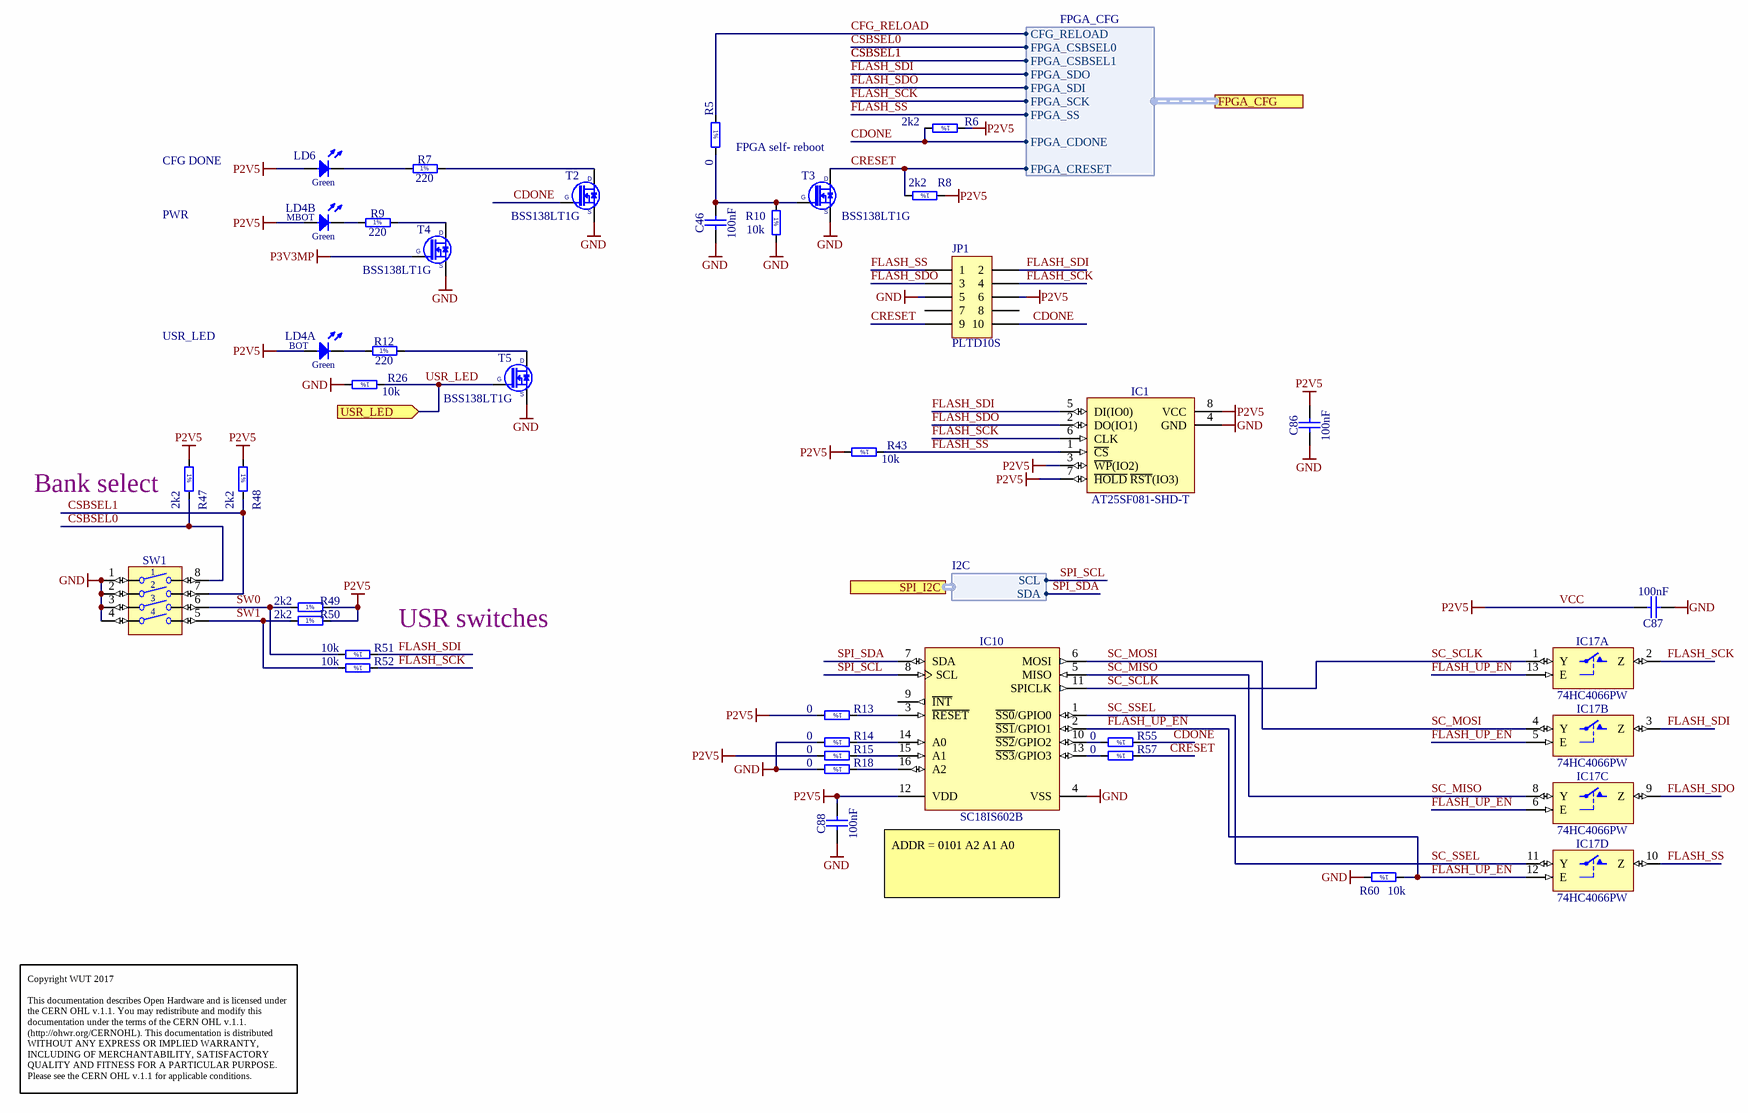
[diagram p8: FPGA_Config.SchDoc]

### Parts
C46  100nF  [CAPC1005X55N]
C86  100nF  [CAPC1005X55N]
C87  100nF  [CAPC1005X55N]
C88  100nF  [CAPC1005X55N]
IC1  AT25SF081-SHD-T  [SOIC127P790X216-8N]
IC10  SC18IS602B  [SOP65P640X110-16N]
IC17  74HC4066PW  [SOP65P640X110-14N]  (parts A,B,C,D of 4)
JP1  PLTD10S  [PLTD10S]
LD4  Green/Green/HeRed/HeRed  [LED_BIVAR_H485CHHGGDL]  (value not drawn)  (parts A,B of 4)
LD6  Green  [LED_KINGBRIGHT_KPH-1608CGCK]  (value not drawn)
R5  0  [RESC1608X55N]
R6  2k2  [RESC1005X40N]
R7  220  [RESC1608X55N]
R8  2k2  [RESC1005X40N]
R9  220  [RESC1608X55N]
R10  10k  [RESC1005X40N]
R12  220  [RESC1608X55N]
R13  0  [RESC1608X55N]
R14  0  [RESC1608X55N]
R15  0  [RESC1608X55N]
R18  0  [RESC1608X55N]
R26  10k  [RESC1005X40N]
R43  10k  [RESC1005X40N]
R47  2k2  [RESC1005X40N]
R48  2k2  [RESC1005X40N]
R49  2k2  [RESC1005X40N]
R50  2k2  [RESC1005X40N]
R51  10k  [RESC1005X40N]
R52  10k  [RESC1005X40N]
R55  0  [RESC1608X55N]
R57  0  [RESC1608X55N]
R60  10k  [RESC1005X40N]
SW1  Switch  [SW_TYCO_1571983-4]  (value not drawn)
T2  BSS138LT1G  [SOT95P240X110-3N]
T3  BSS138LT1G  [SOT95P240X110-3N]
T4  BSS138LT1G  [SOT95P240X110-3N]
T5  BSS138LT1G  [SOT95P240X110-3N]

### Ports
FPGA_CFG (harness FPGA_CFG), SPI_I2C (harness I2C), USR_LED (in)

### Harnesses
I2C: SDA, SCL
FPGA_CFG: FPGA_CSBSEL0, FPGA_CSBSEL1, FPGA_SDO, FPGA_SDI, FPGA_SCK, FPGA_SS, FPGA_CDONE, FPGA_CRESET, CFG_RELOAD

### Nets
GND: C46.1 C86.1 C87.1 C88.1 IC1.4(GND) IC10.4(VSS) IC17.7(GND) JP1.5 R10.2 R14.2 R18.2 R26.2 R60.2 SW1.1 SW1.2 SW1.3 SW1.4 T2.2(S) T3.2(S) T4.2(S) T5.2(S)
P2V5: C86.2 C87.2 C88.2 IC1.3(~{WP}(IO2)) IC1.7(~{HOLD}_~{RST}(IO3)) IC1.8(VCC) IC10.12(VDD) IC17.14(VCC) JP1.6 LD4.2(A) LD4.4(A) LD6.2(A) R6.1 R8.1 R13.2 R15.2 R43.2 R47.1 R48.1 R49.2 R50.2  [also labelled VCC]
P3V3MP: T4.1(G)
CDONE: JP1.10 R6.2 R55.1 T2.1(G) ; port FPGA_CFG.FPGA_CDONE
CFG_RELOAD: R5.1 ; port FPGA_CFG.CFG_RELOAD
CRESET: JP1.9 R8.2 R57.1 T3.3(D) ; port FPGA_CFG.FPGA_CRESET
CSBSEL0: R47.2 SW1.8 ; port FPGA_CFG.FPGA_CSBSEL0
CSBSEL1: R48.2 SW1.7 ; port FPGA_CFG.FPGA_CSBSEL1
FLASH_SCK: IC1.6(CLK) IC17.2(Z) JP1.4 R52.1 ; port FPGA_CFG.FPGA_SCK
FLASH_SDI: IC1.5(DI(IO0)) IC17.3(Z) JP1.2 R51.1 ; port FPGA_CFG.FPGA_SDO
FLASH_SDO: IC1.2(DO(IO1)) IC17.9(Z) JP1.3 ; port FPGA_CFG.FPGA_SDI
FLASH_SS: IC1.1(~{CS}) IC17.10(Z) JP1.1 R43.1 ; port FPGA_CFG.FPGA_SS
FLASH_UP_EN: IC10.2(~{SS1}/GPIO1) IC17.5(E) IC17.6(E) IC17.12(E) IC17.13(E) R60.1
SC_MISO: IC10.5(MISO) IC17.8(Y)
SC_MOSI: IC10.6(MOSI) IC17.4(Y)
SC_SCLK: IC10.11(SPICLK) IC17.1(Y)
SC_SSEL: IC10.1(~{SS0}/GPIO0) IC17.11(Y)
SPI_SCL: IC10.8(SCL) ; port SPI_I2C.SCL
SPI_SDA: IC10.7(SDA) ; port SPI_I2C.SDA
SW0: R49.1 R51.2 SW1.6
SW1: R50.1 R52.2 SW1.5
USR_LED: R26.1 T5.1(G) ; port USR_LED
NetC46_2: C46.2 R5.2 R10.1 T3.1(G)
NetIC10_3: IC10.3(~{RESET}) R13.1
NetIC10_10: IC10.10(~{SS2}/GPIO2) R55.2
NetIC10_13: IC10.13(~{SS3}/GPIO3) R57.2
NetIC10_14: IC10.14(A0) R14.1
NetIC10_15: IC10.15(A1) R15.1
NetIC10_16: IC10.16(A2) R18.1
NetLD4_1: LD4.1(C) R12.1
NetLD4_3: LD4.3(C) R9.1
NetLD6_1: LD6.1(C) R7.1
NetR7_2: R7.2 T2.3(D)
NetR9_2: R9.2 T4.3(D)
NetR12_2: R12.2 T5.3(D)

Not connected (* = marked no-connect by the designer): IC10 9(~{INT}); JP1 7 8

### Notes on the sheet
- CFG DONE
- PWR
- FPGA self- reboot
- USR_LED
- (near R47) Bank select
- USR switches
- ADDR = 0101 A2 A1 A0
- Copyright WUT 2017
  This documentation describes Open Hardware and is licensed under the CERN OHL v.1.1. You may redistribute and modify this documentation under the terms of the CERN OHL v.1.1. (http://ohwr.org/CERNOHL). This documentation is distributed WITHOUT ANY EXPRESS OR IMPLIED WARRANTY, INCLUDING OF MERCHANTABILITY, SATISFACTORY QUALITY AND FITNESS FOR A PARTICULAR PURPOSE. Please see the CERN OHL v.1.1 for applicable conditions.
- Project/Equipment
- Document
- Designer
- Drawn by
- Check.by
- File
- Last Mod.
- Print Date
- Sheet
- Size
- A3
- of
- Rev
- (in symbol LED_BIVAR_H485CHHGGDL, part A) BOT; Green
- (in symbol LED_BIVAR_H485CHHGGDL, part B) MBOT; Green
- (in symbol R0402_2K2_1%_0.0625W_100PPM) 1%
- (in symbol R0402_10K_1%_0.0625W_100PPM) 1%
- (in symbol R0603_0R_JUMPER) 1%
- (in symbol R0603_220R_1%_0.1W_100PPM) 1%

### Library data of the parts
C46 C86-C88 = CC0402_100NF_16V_10%_X5R: as C85 on sheet FPGA; Part Number: CC0402_100NF_16V_10%_X5R; Component Kind: Standard; Component Type: Standard; Pin Count: 2; Value: 100nF; Status: None; Manufacturer Part Number: CC0402_100NF_16V_10%_X5R; Case: 0402; Mounted: Yes; Socket: No; SMD: Yes; Sense: No; Manufacturer1 Example: MURATA; Manufacturer1 ComponentHeight: 0.55mm; HelpURL: \\cern.ch\dfs\Applications\Altium\Datasheets\CC0402_X5R_MURATA_GRM.pdf; Author: CERN DEM JLC; CreateDate: 10.12.2013; LatestRevisionDate: 10.12.2013
IC1 = MEM_AT25SF081-SHD-T: 8M-bit Serial Flash Memory with uniform 4KB sectors and Dual/Quad SPI and QPI; Manufacturer: ADESTO; PressFit: No; Bonding: No; Part Number: AT25SF081-SHD-T; Component Kind: Standard; Component Type: Standard; Device: AT25SF081-SHD-T; PackageDescription: SOIC, 1.27mm Pitch; 8 Pin, 5.285mm W X 5.335mm L X 2.16mm H body, IPC Medium Density; Part Description: 8M-bit Serial Flash Memory with uniform 4KB sectors and Dual/Quad SPI and QPI; Manufacturer Part Number: AT25SF081-SHD-T; Pin Count: 8; Case: SOIC8; Mounted: Yes; Socket: No; SMD: Yes; Sense: No; ComponentHeight: 2.16mm; HelpURL: \\cern.ch\dfs\Applications\Altium\Datasheets\W25Q128FVSIG.pdf; Author: GK; CreateDate: 26/01/2018; LatestRevisionDate: 26/01/2018
IC10 = SC18IS602B: I2C-bus to SPI bridge; Manufacturer: NXP SEMICONDUCTORS; PressFit: No; Bonding: No; Part Number: SC18IS602B; Component Kind: Standard; Component Type: Standard; Device: SC18IS602B; PackageDescription: SOP, 0.65mm pitch; 16 pin, 4.40mm W X 5.00mm L X 1.10mm H body IPC Medium Density; Part Description: I2C-Bus to SPI Bridge; Manufacturer Part Number: SC18IS602B; Pin Count: 16; Case: TSSOP16; Mounted: Yes; Socket: No; SMD: Yes; Sense: No; ComponentHeight: 1.1mm; HelpURL: \\cern.ch\dfs\Applications\Altium\Datasheets\SC18IS602B.pdf; Author: CERN DEM MR; CreateDate: 14/12/2015; LatestRevisionDate: 14/12/2015
IC17 = 74HC4066PW: Part Description: Quad Single-Pole Single-Throw Analog Switch; Manufacturer: NXP SEMICONDUCTORS; PressFit: No; Bonding: No; Table: Standard Logic; Part Number: 74HC4066PW; Component Kind: Standard; Component Type: Standard; Device: 74HC4066PW; PackageDescription: SOP, 14-Leads, Body 4.4x5mm (max), Pitch 0.65mm, IPC Medium Density; Manufacturer Part Number: 74HC4066PW; Pin Count: 14; Case: TSSOP14; Mounted: Yes; Socket: No; SMD: Yes; ComponentHeight: 1.1mm; Author: CERN DEM JLC; HelpURL: \\cern.ch\dfs\Applications\Altium\Datasheets\74HC4066PW.pdf; CreateDate: 2014-11-19; LatestRevisionDate: 2014-11-19
JP1 = CON_2x5 2.54 male SMT: Goldpin 2.54mm, male header
LD4 = LED_BIVAR_H485CHHGGDL: as LD4 on sheet Supply; Part Number: LED_BIVAR_H485CHHGGDL; Component Kind: Standard; Component Type: Standard; Color: Green/Green/HeRed/HeRed; PackageDescription: Quad-Level 2mm (Green+Green+HeRed+HeRed) LED, PCB Edge Mounting  BIVAR H485C Serie; Status: Not Recommended; Manufacturer Part Number: H485CHHGGDL; Pin Count: 8; Mounted: Yes; Socket: No; SMD: No; Sense: No; ComponentHeight: 11.3mm; HelpURL: \\cern.ch\dfs\Applications\Altium\Datasheets\LED_BIVAR_H485C.pdf; Author: CERN DEM BC; CreateDate: 12/11/2015; LatestRevisionDate: 12/11/2015
LD6 = LED_KINGBRIGHT_KPH-1608CGCK: as LD1 on sheet Supply; Part Number: LED_KINGBRIGHT_KPH-1608CGCK; Component Kind: Standard; Component Type: Standard; Color: Green; PackageDescription: SMT Green LED, Case 0603, Body L 1.6 x W 0.8mm H 0.65mm; Manufacturer: KINGBRIGHT; Manufacturer Part Number: KPH-1608CGCK; Pin Count: 2; Mounted: Yes; Socket: No; SMD: Yes; Sense: No; ComponentHeight: 0.65mm; HelpURL: \\cern.ch\dfs\Applications\Altium\Datasheets\LED_KINGBRIGHT_KPH-1608CGCK.pdf; Author: CERN DEM JLC; CreateDate: 03.07.2017; LatestRevisionDate: 03.07.2017
R5 R13-R15 R18 R55 R57 = R0603_0R_JUMPER: Resistor - 1%; Part Description: 1A (0.05R Max DC Resistance) Zero Ohm Jumper; Manufacturer: GENERIC; Manufacturer1 Part Number: NRC06Z0; Table: Resistors SMD; Part Number: R0603_0R_JUMPER; Component Kind: Standard; Component Type: Standard; Pin Count: 2; Value: 0; Status: Preferred; Manufacturer Part Number: R0603_0R_JUMPER; Case: 0603; Mounted: Yes; Socket: No; SMD: Yes; Manufacturer1 Example: NIC COMPONENT; Manufacturer1 ComponentHeight: 0.55mm; HelpURL: \\cern.ch\dfs\Applications\Altium\Datasheets\R0603_NIC_NRC.pdf; Author: CERN DEM JLC; CreateDate: 2007-12-03; LatestRevisionDate: 2008-03-13
R6 R8 R47-R50 = R0402_2K2_1%_0.0625W_100PPM: Resistor - 1%; Part Description: General Purpose Thick Film Chip Resistor; Manufacturer: GENERIC; Manufacturer1 Part Number: 232270672202L; TC: ±100ppm/°C; Table: Resistors SMD; Part Number: R0402_2K2_1%_0.0625W_100PPM; Component Kind: Standard; Component Type: Standard; Pin Count: 2; Value: 2k2; Status: Not recommended; Power: 0.0625W; Tolerance: ±1%; Manufacturer Part Number: R0402_2K2_1%_0.0625W_100PPM; Case: 0402; Mounted: Yes; Socket: No; SMD: Yes; Manufacturer1 Example: YAGEO PHYCOMP; Manufacturer1 ComponentHeight: 0.4mm; HelpURL: \\cern.ch\dfs\Applications\Altium\Datasheets\R0402_Phycomp_RC0402.pdf; Author: CERN DEM JLC; CreateDate: 2007-12-03; LatestRevisionDate: 2012-10-17
R7 R9 R12 = R0603_220R_1%_0.1W_100PPM: as R62 on sheet Supply; Part Number: R0603_220R_1%_0.1W_100PPM; Component Kind: Standard; Component Type: Standard; Pin Count: 2; Value: 220; Status: Preferred; Tolerance: ±1%; Manufacturer Part Number: R0603_220R_1%_0.1W_100PPM; Case: 0603; Mounted: Yes; Sense: No; Socket: No; SMD: Yes; Manufacturer1 Example: NIC COMPONENT; Manufacturer1 ComponentHeight: 0.55mm; HelpURL: \\cern.ch\dfs\Applications\Altium\Datasheets\R0603_NIC_NRC.pdf; Author: CERN DEM JLC; CreateDate: 03.12.2007; LatestRevisionDate: 13.03.2008
R10 R26 R43 R51 R52 R60 = R0402_10K_1%_0.0625W_100PPM: as R146 on sheet I2C_switch; Part Number: R0402_10K_1%_0.0625W_100PPM; Component Kind: Standard; Component Type: Standard; Pin Count: 2; Value: 10k; Status: Not recommended; Power: 0.0625W; Tolerance: ±1%; Manufacturer Part Number: R0402_10K_1%_0.0625W_100PPM; Case: 0402; Mounted: Yes; Socket: No; SMD: Yes; Manufacturer1 Example: YAGEO PHYCOMP; Manufacturer1 ComponentHeight: 0.4mm; HelpURL: \\cern.ch\dfs\Applications\Altium\Datasheets\R0402_Phycomp_RC0402.pdf; Author: CERN DEM JLC; CreateDate: 2007-12-03; LatestRevisionDate: 2012-10-17
SW1 = SW_TYCO_1571983-4: 4 Ways SPST DIP Switch; Part Description: 4 Way SPST SMD DIP Switch, Latched, Contact Rating 0.025A 24VDC; Manufacturer: TYCO; Manufacturer Part Number: 1571983-4 or GDH04S04; PressFit: No; Part Number: SW_TYCO_1571983-4; Component Kind: Standard; Component Type: Standard; Pin Count: 8; PackageDescription: Pitch 1.27mm,  Body 6.2x6.2mm, 4 Ways SPST Surface-Mount DIP Switch, TYCO GDH Series; Family: Switch; Mounted: Yes; Socket: No; SMD: Yes; Sense: No; Status: None; ComponentHeight: 2.31mm; HelpURL: \\cern.ch\dfs\Applications\Altium\Datasheets\SW_TYCO_1571983-4.pdf; Author: CERN DEM JLC; CreateDate: 08/01/2009; LatestRevisionDate: 08/01/2009
T2-T5 = BSS138LT1G: as T1 on sheet I2C_switch; Part Number: BSS138LT1G; Component Kind: Standard; Component Type: Standard; Device: BSS138LT1G; PackageDescription: SOT23 3-Leads, Pitch 0.95mm - Body 1.4x3mm, IPC Medium Density; Manufacturer Part Number: BSS138LT1G; Pin Count: 3; Case: SOT23-3; Mounted: Yes; Socket: No; SMD: Yes; Sense: No; ComponentHeight: 1.11mm; HelpURL: \\cern.ch\dfs\Applications\Altium\Datasheets\BSS138LT1G.pdf; Author: CERN DEM JLC; CreateDate: 23/03/2009; LatestRevisionDate: 23/03/2009